# Altium schematic sheet Flash.SchDoc
size A4; SheetNumber: 4; SheetTotal: 6
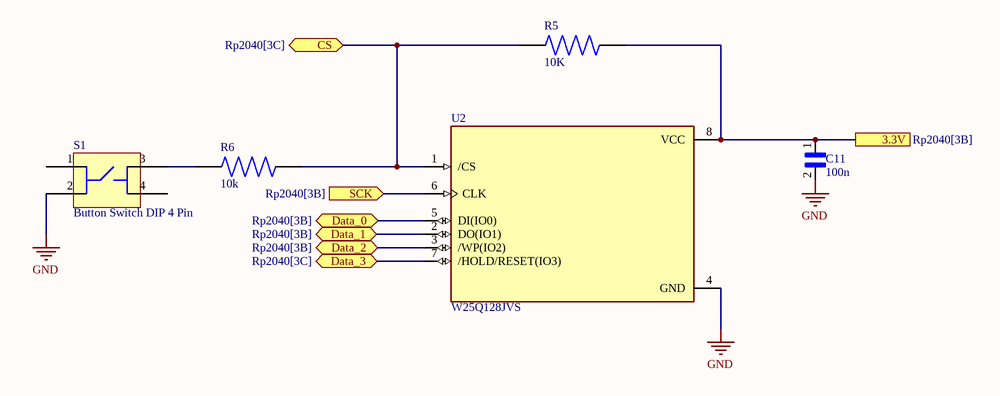
[diagram p0: Flash.SchDoc]

## Parts
C11  100n  [SMD Capacator]
R5  10K  [SMD Resistor]
R6  10k  [SMD Resistor]
S1  Button Switch DIP 4 Pin  [Button Switch DIP 4 Pin]
U2  W25Q128JVS  [W25Q128JVS]

## Ports
3.3V (see Rp2040[3B]), CS (bidir, see Rp2040[3C]), Data_0 (bidir, see Rp2040[3B]), Data_1 (bidir, see Rp2040[3B]), Data_2 (bidir, see Rp2040[3B]), Data_3 (bidir, see Rp2040[3C]), SCK (in, see Rp2040[3B])

## Nets
GND: C11.2 S1.2 U2.4(GND)
3.3V: C11.1 R5.2 U2.8(VCC) ; port 3.3V
CS: R5.1 R6.2 U2.1(/CS) ; port CS
Data_0: U2.5(DI(IO0)) ; port Data_0
Data_1: U2.2(DO(IO1)) ; port Data_1
Data_2: U2.3(/WP(IO2)) ; port Data_2
Data_3: U2.7(/HOLD/RESET(IO3)) ; port Data_3
SCK: U2.6(CLK) ; port SCK
NetR6_1: R6.1 S1.3

Not connected (* = marked no-connect by the designer): S1 1 4

## Library data of the parts
C11 = SMD Capacator
R5 R6 = SMD Resistor